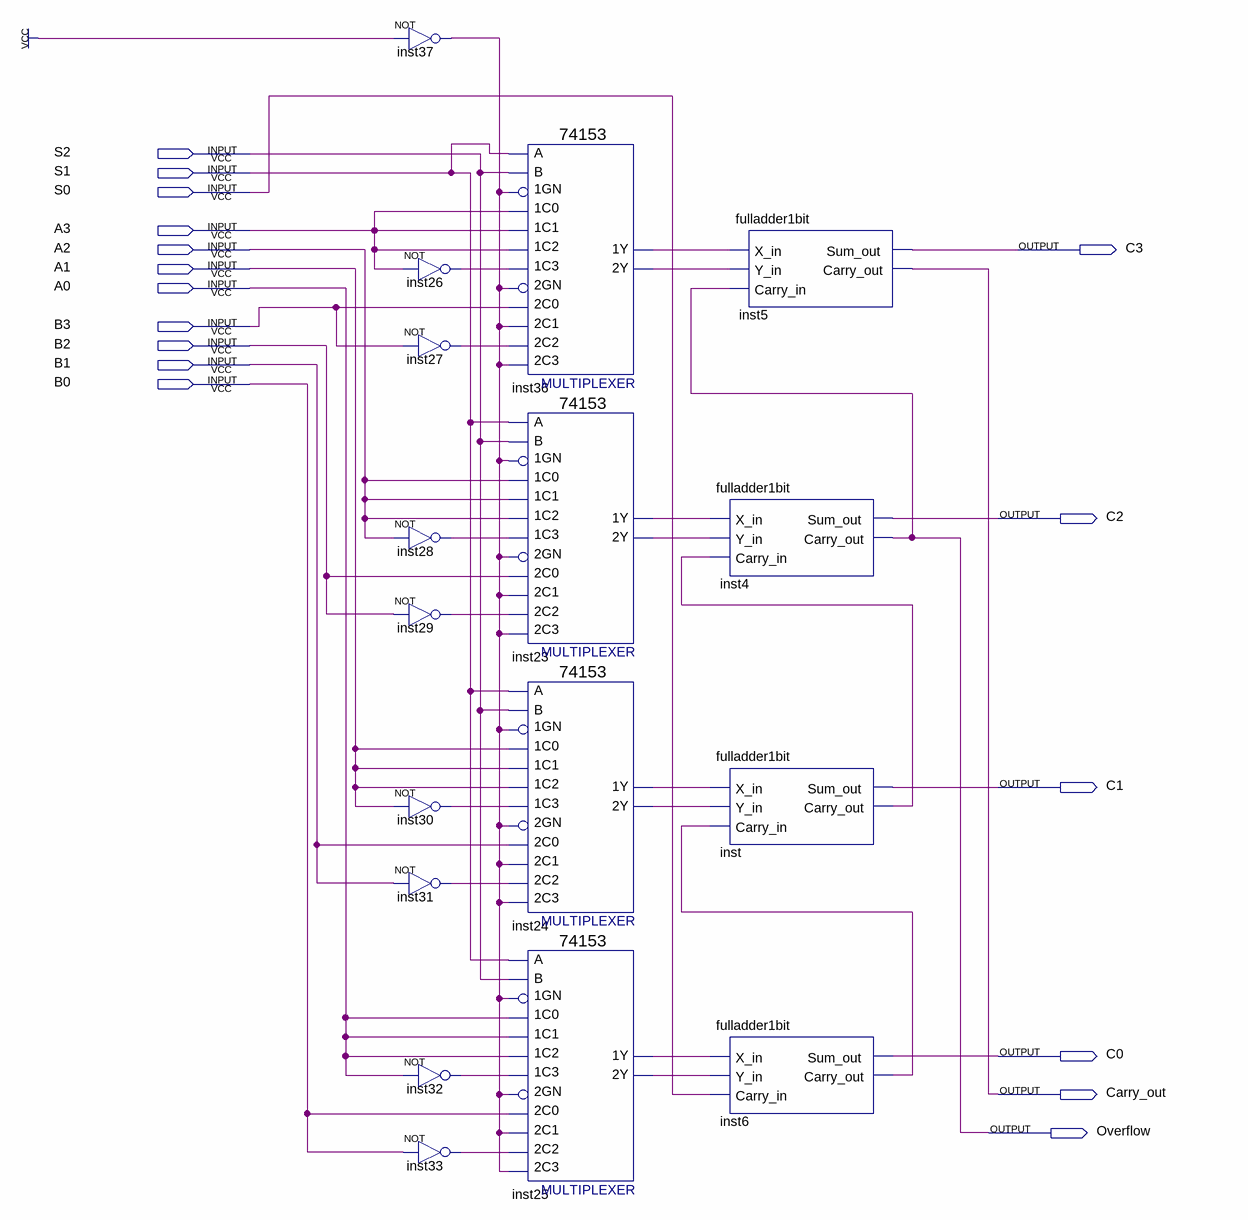
[diagram p0: schematic sheet]
// Quartus schematic arithcircuit4bits.bdf as structural Verilog: 17 symbols, 17 pins
module arithcircuit4bits (
  input  S2,
  input  S1,
  input  S0,
  input  A3,
  input  A2,
  input  A1,
  input  A0,
  input  B3,
  input  B2,
  input  B1,
  input  B0,
  output C3,
  output C2,
  output C1,
  output C0,
  output Carry_out,
  output Overflow
);

  wire inst6_carry_out, inst23_1y, inst23_2y, inst24_1y, inst24_2y, inst25_1y, inst25_2y, inst26_out,
       inst27_out, inst28_out, inst29_out, inst30_out, inst31_out, inst32_out, inst33_out, inst36_1y,
       inst36_2y, inst37_out, inst_carry_out;

  not inst37 (inst37_out, 1'b1);
  not inst28 (inst28_out, A2);
  not inst29 (inst29_out, B2);
  not inst30 (inst30_out, A1);
  not inst31 (inst31_out, B1);
  not inst26 (inst26_out, A3);
  not inst27 (inst27_out, B3);
  not inst32 (inst32_out, A0);
  not inst33 (inst33_out, B0);
  \74153  inst36 (
    .\1C1 (A3), .\1GN (inst37_out), .\1C0 (A3), .\2C0 (B3), .\2GN (inst37_out), .\2C2 (inst27_out),
    .\1C2 (A3), .\1C3 (inst26_out), .B(S2), .A(S1), .\2C1 (inst37_out), .\2C3 (inst37_out), .\1Y (inst36_1y),
    .\2Y (inst36_2y));
  \74153  inst23 (
    .\1C1 (A2), .\1GN (inst37_out), .\1C0 (A2), .\2C0 (B2), .\2GN (inst37_out), .\2C2 (inst29_out),
    .\1C2 (A2), .\1C3 (inst28_out), .B(S2), .A(S1), .\2C1 (inst37_out), .\2C3 (inst37_out), .\1Y (inst23_1y),
    .\2Y (inst23_2y));
  \74153  inst24 (
    .\1C1 (A1), .\1GN (inst37_out), .\1C0 (A1), .\2C0 (B1), .\2GN (inst37_out), .\2C2 (inst31_out),
    .\1C2 (A1), .\1C3 (inst30_out), .B(S2), .A(S1), .\2C1 (inst37_out), .\2C3 (inst37_out), .\1Y (inst24_1y),
    .\2Y (inst24_2y));
  \74153  inst25 (
    .\1C1 (A0), .\1GN (inst37_out), .\1C0 (A0), .\2C0 (B0), .\2GN (inst37_out), .\2C2 (inst33_out),
    .\1C2 (A0), .\1C3 (inst32_out), .B(S2), .A(S1), .\2C1 (inst37_out), .\2C3 (inst37_out), .\1Y (inst25_1y),
    .\2Y (inst25_2y));
  fulladder1bit inst5 (.X_in(inst36_1y), .Y_in(inst36_2y), .Carry_in(Overflow), .Sum_out(C3), .Carry_out(Carry_out));
  fulladder1bit inst4 (
    .X_in(inst23_1y), .Y_in(inst23_2y), .Carry_in(inst_carry_out), .Sum_out(C2), .Carry_out(Overflow));
  fulladder1bit inst (
    .X_in(inst24_1y), .Y_in(inst24_2y), .Carry_in(inst6_carry_out), .Sum_out(C1), .Carry_out(inst_carry_out));
  fulladder1bit inst6 (.X_in(inst25_1y), .Y_in(inst25_2y), .Carry_in(S0), .Sum_out(C0), .Carry_out(inst6_carry_out));
endmodule
